# EAGLE design External_Controls_Board (EAGLE 6.6.0)
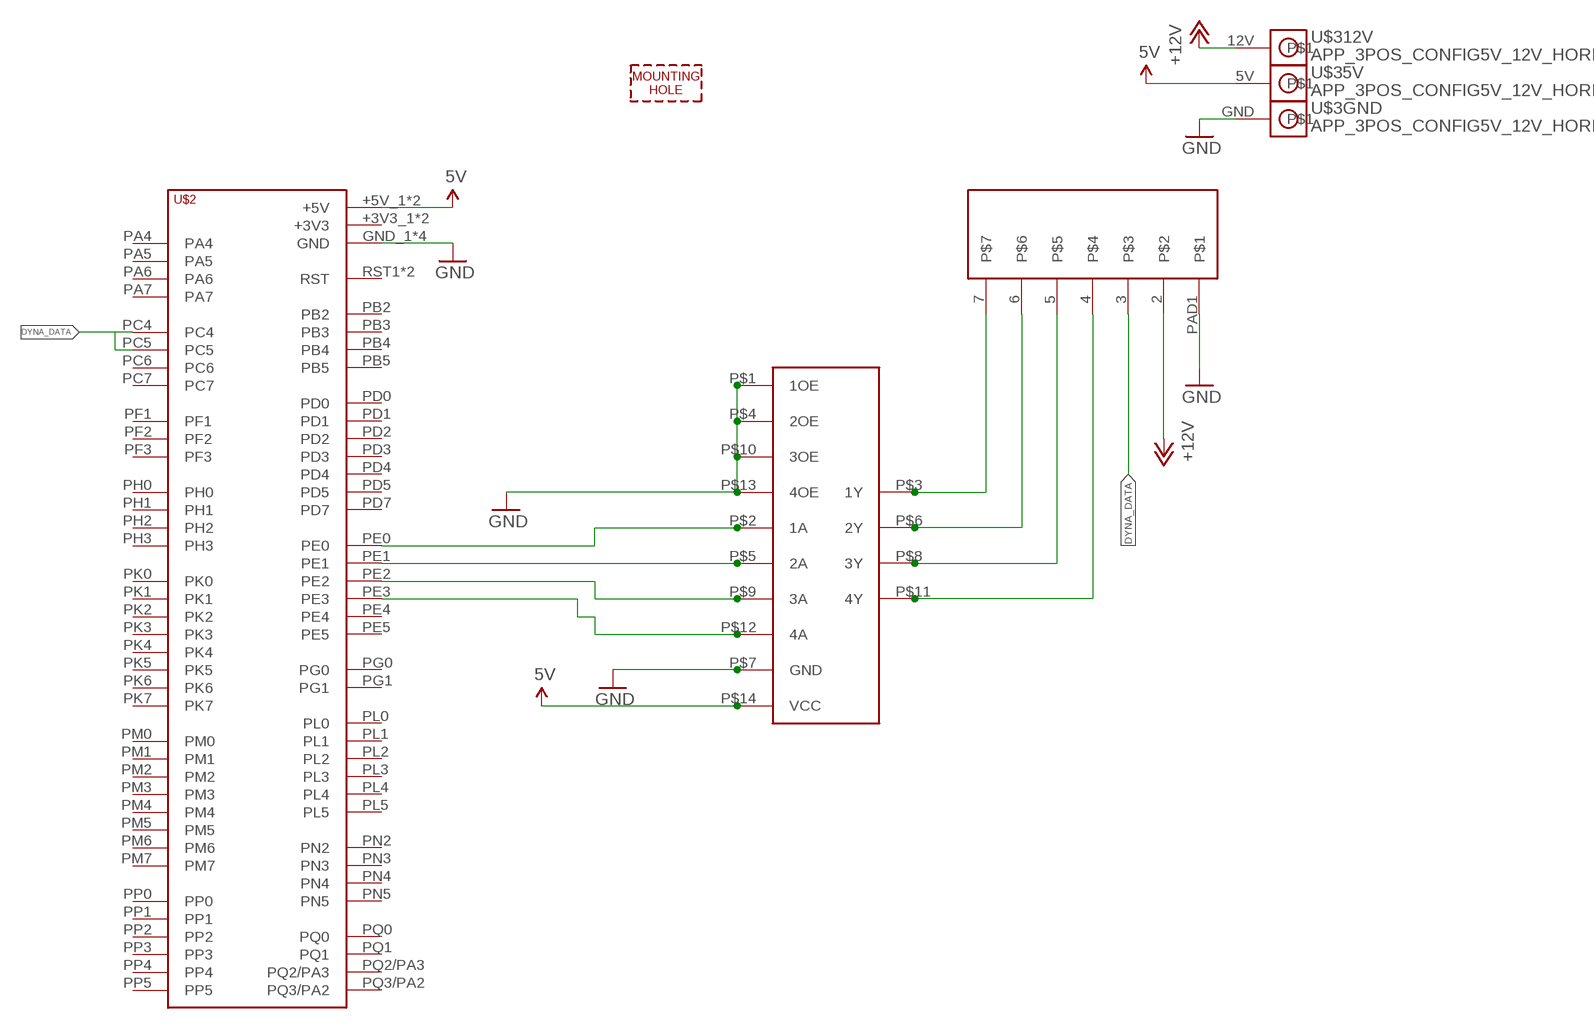
[diagram p0: schematic, sheet 1]

## Parts
U$1  74AHCT125  [DIP16]
U$2  TIVA-C-CONNECTED  [TIVA-C-CONNECTED]
U$3  APP_3POS_CONFIG5V_12V_HORIZ  [APP45_5V_12V_HORIZ_CONFIG]
U$6  MOUNTING_HOLE#8  [#8_SCREW]
U$8  MOLEX7-PIN  [MOLEX7PIN]

## Nets
+5V: U$1.P$14(VCC) U$2.+5V_1(+5V) U$2.+5V_2(+5V) U$3.5V ; supply symbol labelled 5V
+12V: U$3.12V U$8.2
DYNA_DATA: U$2.PC4 U$2.PC5 U$8.3
GND: U$1.P$1(1OE) U$1.P$4(2OE) U$1.P$7(GND) U$1.P$10(3OE) U$1.P$13(4OE) U$2.GND_1(GND) U$2.GND_2(GND) U$2.GND_3(GND) U$2.GND_4(GND) U$3.GND U$8.PAD1
N$1: U$1.P$3(1Y) U$8.7
N$2: U$1.P$6(2Y) U$8.6
N$3: U$1.P$8(3Y) U$8.5
N$4: U$1.P$11(4Y) U$8.4
TIVA_PWM0: U$1.P$2(1A) U$2.PE0
TIVA_PWM1: U$1.P$5(2A) U$2.PE1
TIVA_PWM2: U$1.P$9(3A) U$2.PE2
TIVA_PWM3: U$1.P$12(4A) U$2.PE3
Unconnected: U$2.+3V3_1(+3V3) U$2.+3V3_2(+3V3) U$2.PA4 U$2.PA5 U$2.PA6 U$2.PA7 U$2.PB2 U$2.PB3 U$2.PB4 U$2.PB5 U$2.PC6 U$2.PC7 U$2.PD0 U$2.PD1 U$2.PD2 U$2.PD3 U$2.PD4 U$2.PD5 U$2.PD7 U$2.PE4 U$2.PE5 U$2.PF1 U$2.PF2 U$2.PF3 U$2.PG0 U$2.PG1 U$2.PH0 U$2.PH1 U$2.PH2 U$2.PH3 U$2.PK0 U$2.PK1 U$2.PK2 U$2.PK3 U$2.PK4 U$2.PK5 U$2.PK6 U$2.PK7 U$2.PL0 U$2.PL1 U$2.PL2 U$2.PL3 U$2.PL4 U$2.PL5 U$2.PM0 U$2.PM1 U$2.PM2 U$2.PM3 U$2.PM4 U$2.PM5 U$2.PM6 U$2.PM7 U$2.PN2 U$2.PN3 U$2.PN4 U$2.PN5 U$2.PP0 U$2.PP1 U$2.PP2 U$2.PP3 U$2.PP4 U$2.PP5 U$2.PQ0 U$2.PQ1 U$2.PQ2/PA3 U$2.PQ3/PA2 U$2.RST1(RST) U$2.RST_2(RST)

## Library data of the parts
U$1 = logicShifter:74AHCT125
U$2 = MRDT-2015-General:TIVA-C-CONNECTED: TIVA C CONNECTED LAUNCHPAD
U$3 = MRDT-Connectors:APP_3POS_CONFIG; COLOR1: YELLOW; COLOR2: RED; COLOR3: BLACK
U$6 = MRDT-Hardware:MOUNTING_HOLE: Mounting hole for M6 bolt. Standard use mounting hole for: Tiva C Connected - M6 Anderson Powerpole Mounting Wing - M8 Most frame-mounted PCB's - M8
U$8 = logicShifter:MOLEX7-PIN; TEST: 1

## Board
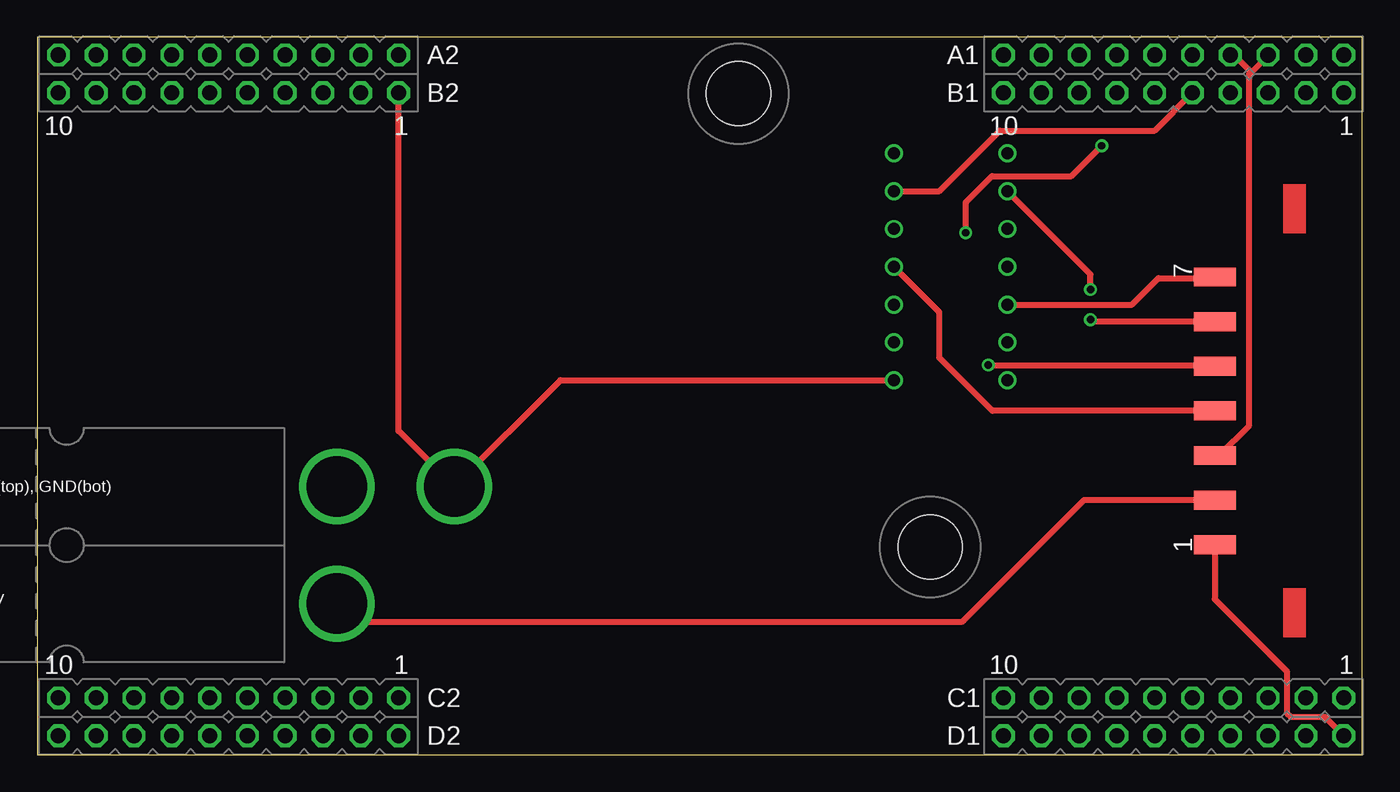
[diagram p1: board, top side]
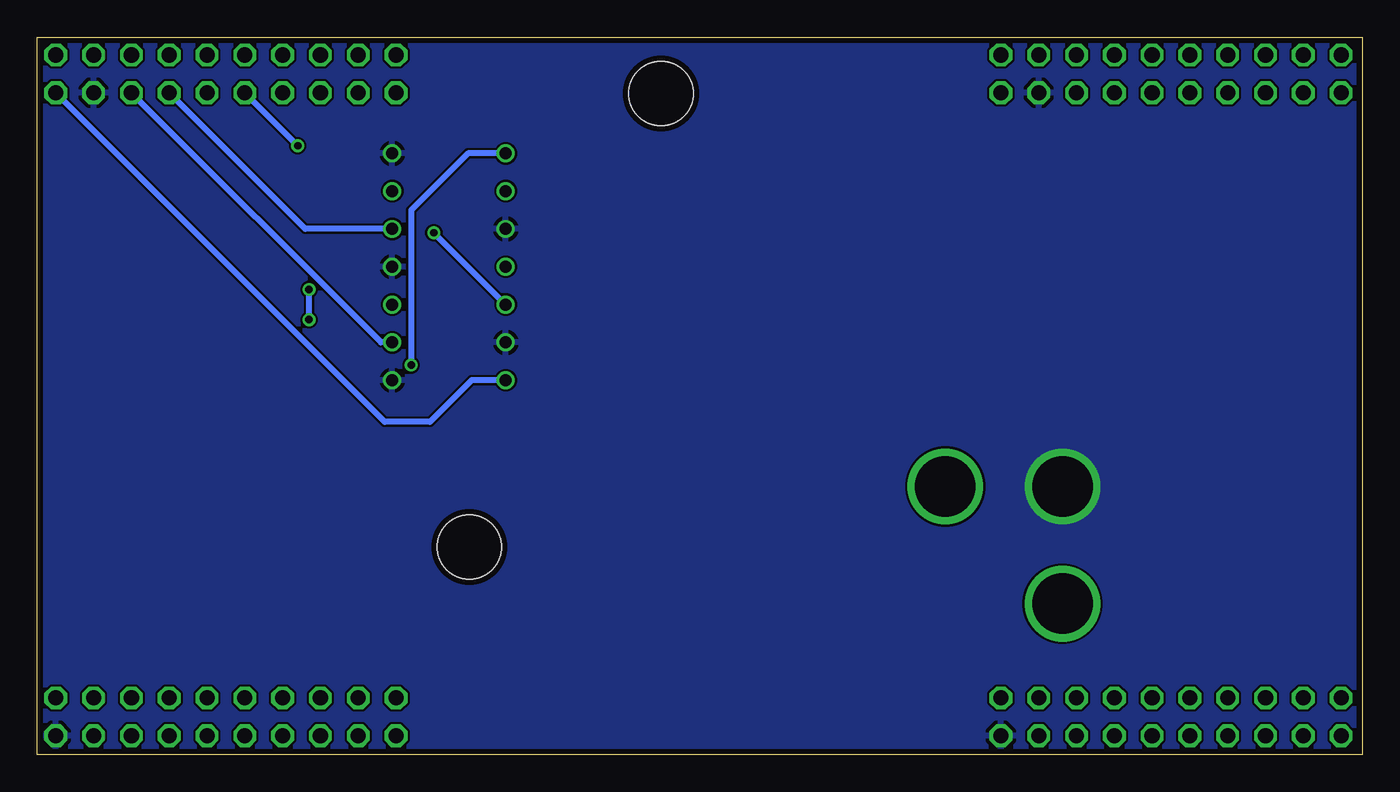
[diagram p2: board, bottom side, seen from below]

Size 89.03 x 48.18 mm. Coordinates in mm from the lower left corner, seen from the top.
Outline: 0,0 89.03,0 89.03,48.18 0,48.18 0,0
Copper layers (1*16): Top 0.0356mm / dielectric 1.5011mm / Bottom 0.0356mm
Design rules "LaenPCBOrder": minimum track width 6mil, minimum drill 13mil, track to track 6mil, track to pad 6mil, pad to pad 6mil, via to via 6mil, smd to smd 6mil, copper to edge 15mil, drill to drill 6mil, minimum pad ring 7mil, minimum via ring 7mil, stop-mask expansion 3mil, vias tented up to drill 0mil, thermal gap 10mil

### Footprints (pad centres in the part's own frame; a part is rotated, then mirrored left to right if it is on the bottom)
DIP16 = drill 0.8: P$1 0,0; P$2 0,-2.54; P$3 0,-5.08; P$4 0,-7.62; P$5 0,-10.16; P$6 0,-12.7; P$7 0,-15.24; P$8 7.62,-15.24; P$9 7.62,-12.7; P$10 7.62,-10.16; P$11 7.62,-7.62; P$12 7.62,-5.08; P$13 7.62,-2.54; P$14 7.62,0
TIVA-C-CONNECTED = drill 1.016 octagon: +3V3_1 59.69,54.61; +3V3_2 123.19,54.61; +5V_1 59.69,52.07; +5V_2 123.19,52.07; GND_1 57.15,52.07; GND_2 59.69,8.89; GND_3 120.65,52.07; GND_4 123.19,8.89; PA4 39.37,52.07; PA5 36.83,52.07; PA6 105.41,52.07; PA7 52.07,8.89; PB2 102.87,54.61; PB3 100.33,54.61; PB4 54.61,52.07; PB5 52.07,52.07; PC4 118.11,54.61; PC5 115.57,54.61; PC6 113.03,54.61; PC7 105.41,54.61; PD0 107.95,8.89; PD1 110.49,8.89; PD2 57.15,54.61; PD3 107.95,54.61; PD4 49.53,54.61; PD5 46.99,54.61; PD7 107.95,52.07; PE0 118.11,52.07; PE1 115.57,52.07; PE2 113.03,52.07; PE3 110.49,52.07; PE4 120.65,54.61; PE5 110.49,54.61; PF1 123.19,11.43; PF2 120.65,11.43; PF3 118.11,11.43; PG0 115.57,11.43; PG1 59.69,11.43; PH0 44.45,11.43; PH1 41.91,11.43; PH2 118.11,8.89; PH3 115.57,8.89; PK0 49.53,52.07; PK1 46.99,52.07; PK2 44.45,52.07; PK3 41.91,52.07; PK4 57.15,11.43; PK5 54.61,11.43; PK6 39.37,11.43; PK7 36.83,11.43; PL0 107.95,11.43; PL1 105.41,11.43; PL2 102.87,11.43; PL3 100.33,11.43; PL4 113.03,11.43; PL5 110.49,11.43; PM0 52.07,11.43; PM1 49.53,11.43; PM2 46.99,11.43; PM3 120.65,8.89; PM4 102.87,52.07; PM5 100.33,52.07; PM6 36.83,8.89; PM7 57.15,8.89; PN2 105.41,8.89; PN3 102.87,8.89; PN4 36.83,54.61; PN5 39.37,54.61; PP0 54.61,54.61; PP1 52.07,54.61; PP2 100.33,8.89; PP3 41.91,8.89; PP4 41.91,54.61; PP5 54.61,8.89; PQ0 44.45,54.61; PQ1 39.37,8.89; PQ2/PA3 46.99,8.89; PQ3/PA2 44.45,8.89; RST1 49.53,8.89; RST_2 113.03,8.89
APP45_5V_12V_HORIZ_CONFIG = drill 4.064: 5V 36.068,11.811; 12V 28.194,3.937; GND 28.194,11.811
#8_SCREW = hole 4.318: 0,0
MOLEX7PIN = smd 1.27 x 2.794: 2 9.22,6.121; 3 12.217,6.121; 4 15.215,6.121; 5 18.212,6.121; 6 21.209,6.121; 7 24.206,6.121; PAD1 6.223,6.121

### Placement (x,y rotation side)
U$1  65.18,25.15 180 top
U$2  -35.41,-7.62 0 top
U$3  -8.05,6.2 0 top
U$5  MOUNTING_HOLE#8  [#8_SCREW]  59.99,13.94 0 top
U$6  47.12,44.4 0 top
U$8  85.24,7.87 90 top

### Tracks (layer width: path | path; a pad name or v marks a point on that pad's centre or on a via)
+5V
  Top 0.406: U$2.+5V_1 24.28,21.74 U$3.5V 35.15,25.15 U$1.P$14
  Bottom 0.406: U$1.P$14 59.84,25.15 62.64,22.35 65.68,22.35 U$2.+5V_2
+12V
  Top 0.406: U$8.2 70.33,17.09 62.13,8.89 21.39,8.89 U$3.12V
DYNA_DATA
  Top 0.406: U$8.3 79.43,20.09 81.43,22.1 81.43,45.72 81.56,45.85 | 81.56,45.85 U$2.PC4 | U$2.PC5 80.42,46.99 81.56,45.85
GND
  Top 0.406: U$8.PAD1 79.12,10.44 83.97,5.59 83.97,2.79 84.23,2.54 86.51,2.54 U$2.GND_4
  pour Bottom: 0.15,0 89.05,0 89.05,48.26 0.15,48.26
N$1
  Top 0.406: U$1.P$3 73.56,30.23 75.34,32 79.04,32 U$8.7
N$2  (via drill 0.5)
  Top 0.406: U$8.6 70.89,29.08 v70.76,29.21 | v70.76,31.24 70.76,32.26 U$1.P$6
  Bottom 0.406: v70.76,29.21 v70.76,31.24
N$3  (via drill 0.5)
  Top 0.406: v63.91,26.16 79.04,26.16 U$8.5
  Bottom 0.406: U$1.P$8 60.1,40.39 63.91,36.58 v63.91,26.16
N$4
  Top 0.406: U$8.4 64.19,23.09 60.6,26.67 60.6,29.72 U$1.P$11
TIVA_PWM0
  Bottom 0.406: U$1.P$2 65.94,27.69 U$2.PE0
TIVA_PWM1
  Bottom 0.406: U$1.P$5 71.02,35.31 U$2.PE1
TIVA_PWM2
  Top 0.406: U$1.P$9 60.6,37.85 64.67,41.91 75.08,41.91 U$2.PE2
TIVA_PWM3  (via drill 0.5)
  Top 0.406: v62.38,35.05 62.38,37.08 64.16,38.86 69.49,38.86 v71.53,40.89
  Bottom 0.406: U$1.P$12 v62.38,35.05 | v71.53,40.89 U$2.PE3